# EAGLE design PentaFnord_LedBar_0_91r (EAGLE 6.2)

## Sheet 1 of 2
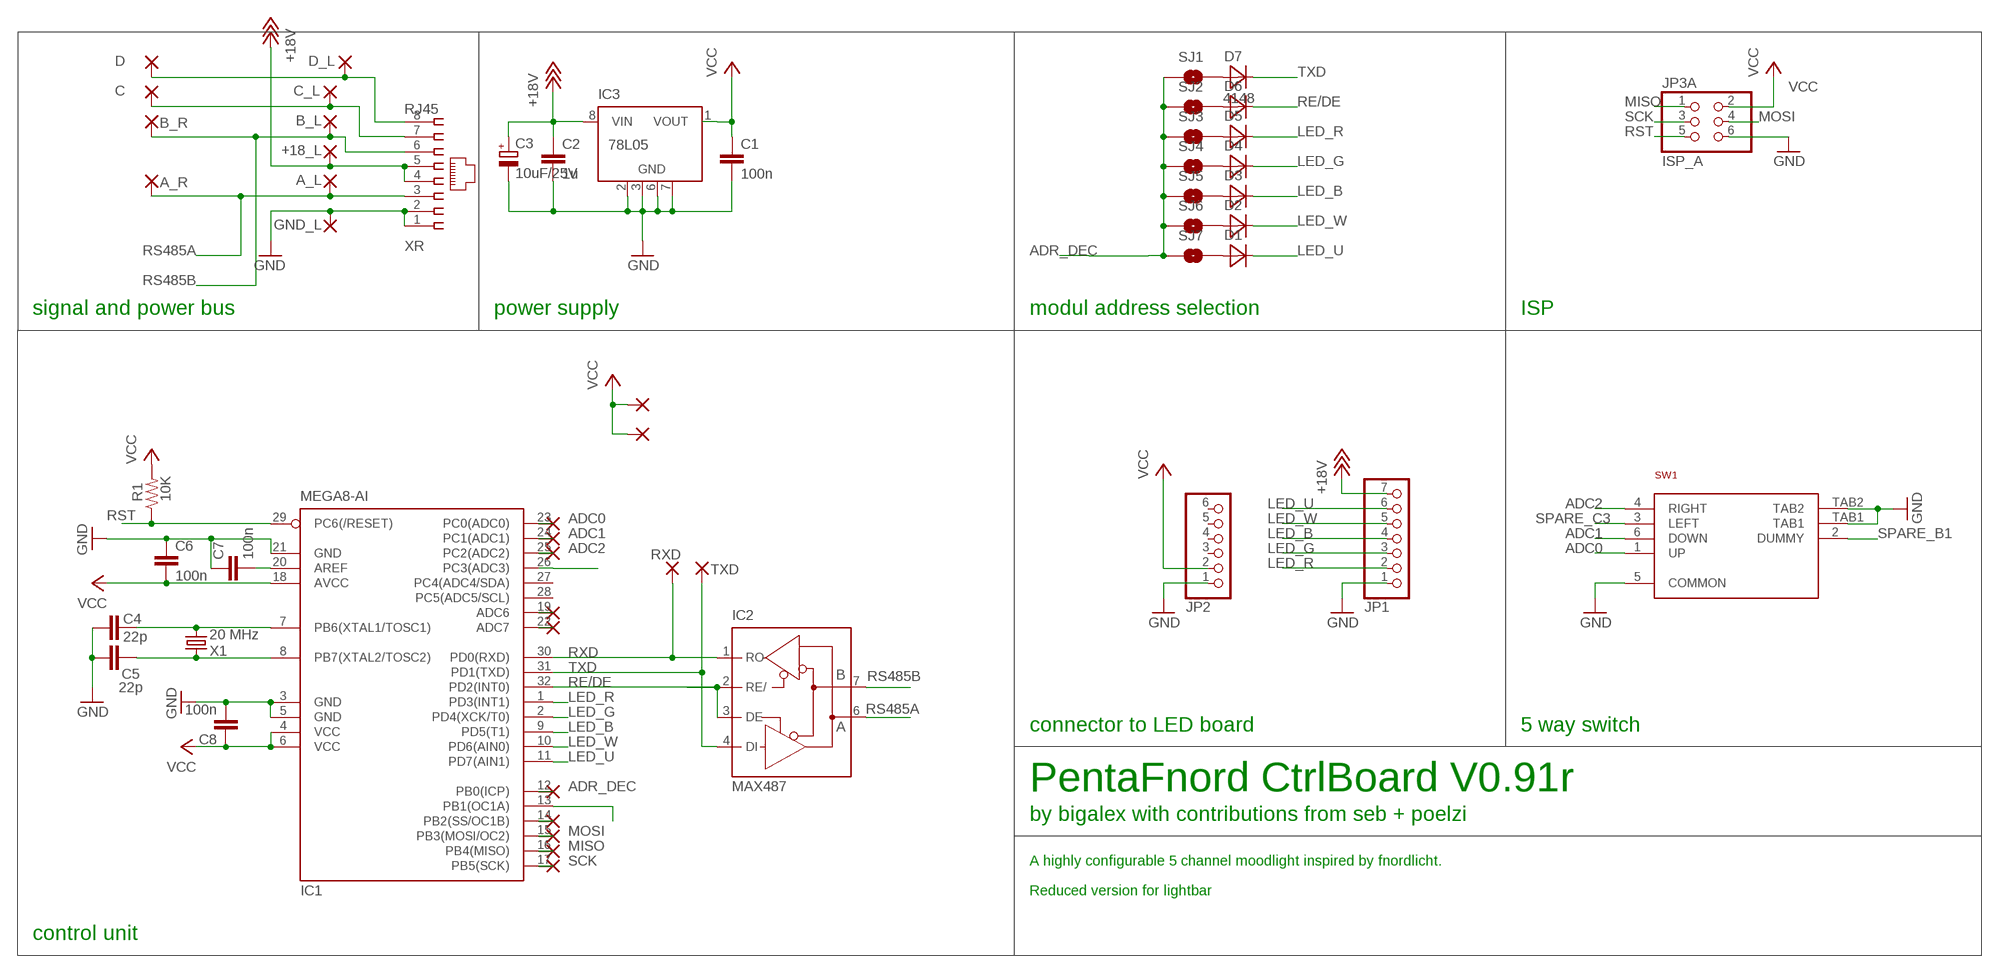
[diagram p0: schematic, sheet 1]

### Parts
+18_L  WIREPADSMD2,54-5,08  [SMD2,54-5,08]
A_L  WIREPADSMD2,54-5,08  [SMD2,54-5,08]
A_R  WIREPADSMD1,27-254  [SMD1,27-2,54]
ADC6  WIREPADSMD1,27-254  [SMD1,27-2,54]
ADC7  WIREPADSMD1,27-254  [SMD1,27-2,54]
B_L  WIREPADSMD2,54-5,08  [SMD2,54-5,08]
B_R  WIREPADSMD1,27-254  [SMD1,27-2,54]
C  WIREPADSMD1,27-254  [SMD1,27-2,54]
C1  100n  CAP0805  [0805]
C2  1u  CAP0805  [0805]
C3  10uF/25V  CPOL-EUSMCD  [SMC_D]
C4  22p  CAP0805  [0805]
C5  22p  CAP0805  [0805]
C6  100n  CAP0805  [0805]
C7  100n  CAP0805  [0805]
C8  100n  CAP0805  [0805]
C_L  WIREPADSMD2,54-5,08  [SMD2,54-5,08]
D  WIREPADSMD1,27-254  [SMD1,27-2,54]
D1  DIODE_0805  [DIODE_0805]
D2  DIODE_0805  [DIODE_0805]
D3  DIODE_0805  [DIODE_0805]
D4  DIODE_0805  [DIODE_0805]
D5  DIODE_0805  [DIODE_0805]
D6  DIODE_0805  [DIODE_0805]
D7  4148  DIODE_0805  [DIODE_0805]
D_L  WIREPADSMD2,54-5,08  [SMD2,54-5,08]
GND_L  WIREPADSMD2,54-5,08  [SMD2,54-5,08]
IC1  MEGA8-AI  [TQFP32-08]
IC2  MAX487  [SO08]
IC3  78L05  78L05SMD  [SO08]
JP1  PINHD-1X07_2.54-SMD-REVERSE  [1X07SMD-REVERSE]
JP2  PINHD-1X06_2.54-SMD  [1X06SMD]
JP3A  ISP_A  PINHD-2X03_2.54-SMD  [2X03SMD]
PAD3  WIREPADSMD1,27-254  [SMD1,27-2,54]
PAD4  WIREPADSMD1,27-254  [SMD1,27-2,54]
PB0  WIREPADSMD1,27-254  [SMD1,27-2,54]
PB2  WIREPADSMD1,27-254  [SMD1,27-2,54]
PB3  WIREPADSMD1,27-254  [SMD1,27-2,54]
PB4  WIREPADSMD1,27-254  [SMD1,27-2,54]
PB5  WIREPADSMD1,27-254  [SMD1,27-2,54]
PC0  WIREPADSMD1,27-254  [SMD1,27-2,54]
PC1  WIREPADSMD1,27-254  [SMD1,27-2,54]
PC2  WIREPADSMD1,27-254  [SMD1,27-2,54]
R1  10K  RESISTOR0805-RES  [0805]
RXD  WIREPADSMD2,54-5,08  [SMD2,54-5,08]
SJ1  SOLDERJUMPERNO  [SJ_2S-NO]
SJ2  SOLDERJUMPERNO  [SJ_2S-NO]
SJ3  SOLDERJUMPERNO  [SJ_2S-NO]
SJ4  SOLDERJUMPERNO  [SJ_2S-NO]
SJ5  SOLDERJUMPERNO  [SJ_2S-NO]
SJ6  SOLDERJUMPERNO  [SJ_2S-NO]
SJ7  SOLDERJUMPERNO  [SJ_2S-NO]
SW1  MCMT5-F-VADAPTED_FOOTPRINT  [MCMT5-F-V_ADAPTED]
TXD  WIREPADSMD2,54-5,08  [SMD2,54-5,08]
X1  20 MHz  CRYSTALSMD-SMALLER  [HC49UP-SMALL]
XR  RJ45  RJ45-SMDRJ45-SMALL  [85502-5008-SMALL]

### Nets
+18V: +18_L.1(P) C2.1 C3.+ IC3.8(VIN) JP1.7 XR.4 XR.5
ADC0: IC1.23(PC0(ADC0)) PC0.1(P) SW1.1(UP)
ADC1: IC1.24(PC1(ADC1)) PC1.1(P) SW1.6(DOWN)
ADC2: IC1.25(PC2(ADC2)) PC2.1(P) SW1.4(RIGHT)
ADR_DEC: IC1.12(PB0(ICP)) PB0.1(P) SJ1.1 SJ2.1 SJ3.1 SJ4.1 SJ5.1 SJ6.1 SJ7.1
GND: C1.2 C2.2 C3.- C4.1 C5.1 C6.1 C7.1 C8.2 GND_L.1(P) IC1.3(GND) IC1.5(GND) IC1.21(GND) IC3.2(GND) IC3.3(GND) IC3.6(GND) IC3.7(GND) JP1.1 JP2.1 JP3A.6 SW1.5(COMMON) SW1.TAB1 SW1.TAB2 XR.1 XR.2
LED_B: D3.1(C) IC1.9(PD5(T1)) JP1.4
LED_G: D4.1(C) IC1.2(PD4(XCK/T0)) JP1.3
LED_R: D5.1(C) IC1.1(PD3(INT1)) JP1.2
LED_U: D1.1(C) IC1.11(PD7(AIN1)) JP1.6
LED_W: D2.1(C) IC1.10(PD6(AIN0)) JP1.5
MISO: IC1.16(PB4(MISO)) JP3A.1 PB4.1(P)
MOSI: IC1.15(PB3(MOSI/OC2)) JP3A.4 PB3.1(P)
N$1: C.1(P) C_L.1(P) XR.7
N$2: D.1(P) D_L.1(P) XR.8
N$4: ADC6.1(P) IC1.19(ADC6)
N$9: ADC7.1(P) IC1.22(ADC7)
N$35: C5.2 IC1.8(PB7(XTAL2/TOSC2)) X1.2
N$36: C4.2 IC1.7(PB6(XTAL1/TOSC1)) X1.1
N$44: C7.2 IC1.20(AREF)
N$45: D7.2(A) SJ1.2
N$46: D6.2(A) SJ2.2
N$47: D5.2(A) SJ3.2
N$48: D4.2(A) SJ4.2
N$50: D3.2(A) SJ5.2
N$51: D2.2(A) SJ6.2
N$52: D1.2(A) SJ7.2
N$55: IC1.14(PB2(SS/OC1B)) PB2.1(P)
RE/DE: D6.1(C) IC1.32(PD2(INT0)) IC2.2(RE/) IC2.3(DE)
RS485A: A_L.1(P) A_R.1(P) IC2.6(A) XR.3
RS485B: B_L.1(P) B_R.1(P) IC2.7(B) XR.6
RST: IC1.29(PC6(/RESET)) JP3A.5 R1.1
RXD: IC1.30(PD0(RXD)) IC2.1(RO) RXD.1(P)
SCK: IC1.17(PB5(SCK)) JP3A.3 PB5.1(P)
SPARE_B1: IC1.13(PB1(OC1A)) SW1.2(DUMMY)
SPARE_C3: IC1.26(PC3(ADC3)) SW1.3(LEFT)
TXD: D7.1(C) IC1.31(PD1(TXD)) IC2.4(DI) TXD.1(P)
VCC: C1.1 C6.2 C8.1 IC1.4(VCC) IC1.6(VCC) IC1.18(AVCC) IC3.1(VOUT) JP2.2 JP3A.2 PAD3.1(P) PAD4.1(P) R1.2
Unconnected: IC1.27(PC4(ADC4/SDA)) IC1.28(PC5(ADC5/SCL)) IC3.4(NC) IC3.5(NC) JP2.3 JP2.4 JP2.5 JP2.6

### Notes on the sheet
- signal and power bus | power supply | modul address selection | ISP
- connector to LED board | 5 way switch
- PentaFnord CtrlBoard V0.91r
- by bigalex with contributions from seb + poelzi
- A highly configurable 5 channel moodlight inspired by fnordlicht.
- Reduced version for lightbar
- control unit

## Sheet 2 of 2
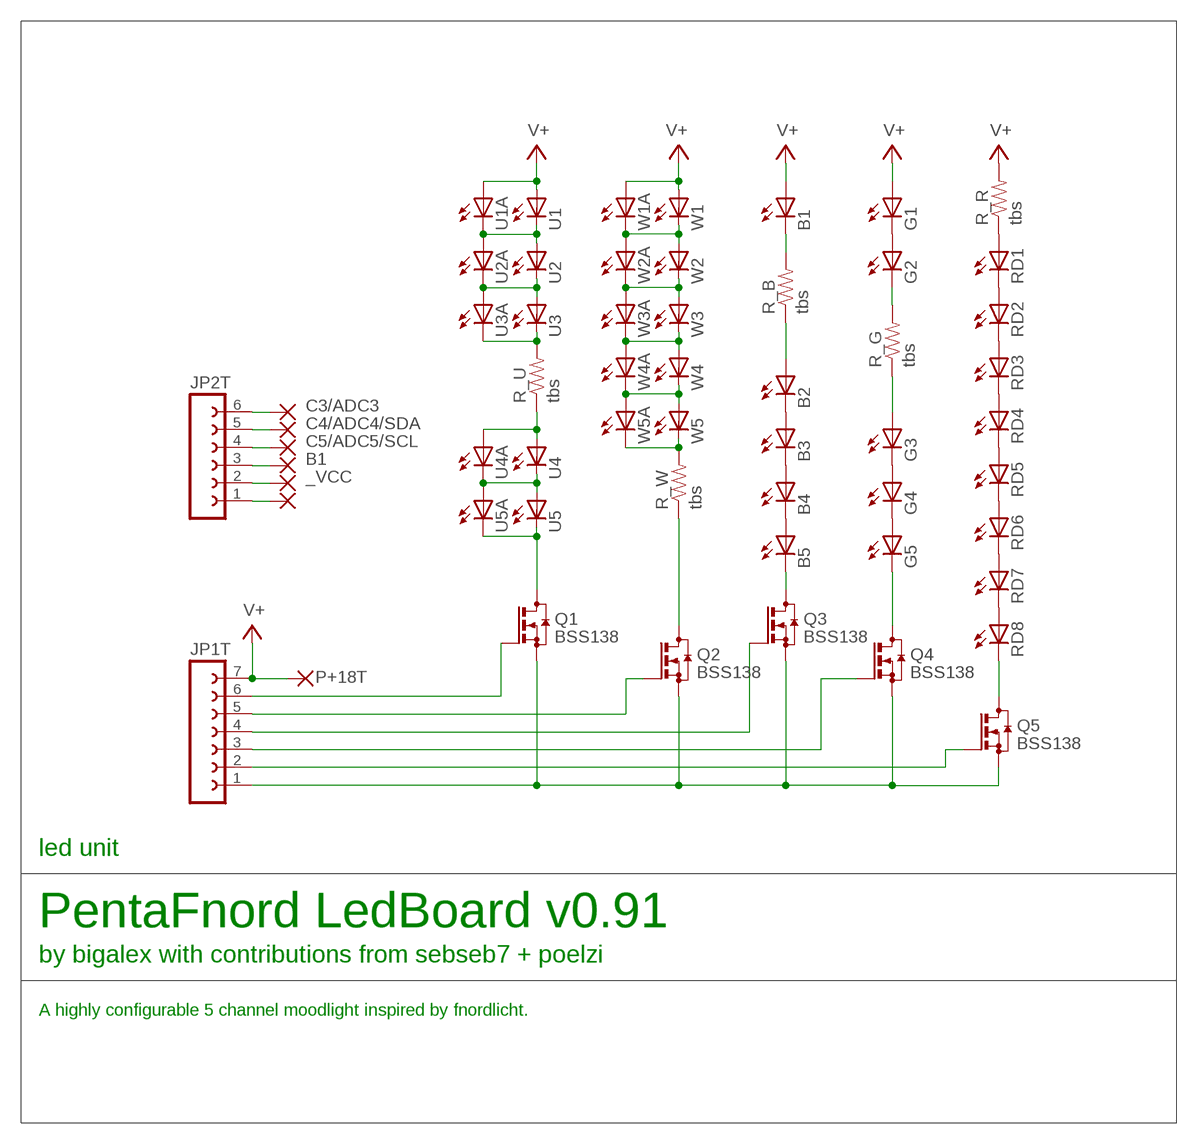
[diagram p1: schematic, sheet 2]

### Parts
B1  LED5MM  [LED5MM]
B2  LED5MM  [LED5MM]
B3  LED5MM  [LED5MM]
B4  LED5MM  [LED5MM]
B5  LED5MM  [LED5MM]
G1  LED5MM  [LED5MM]
G2  LED5MM  [LED5MM]
G3  LED5MM  [LED5MM]
G4  LED5MM  [LED5MM]
G5  LED5MM  [LED5MM]
JP1T  FE07-1  [FE07]
JP2T  FE06-1  [FE06]
P+5T  WIREPAD2,54/0,8  [2,54/0,8]
P+18T  WIREPAD2,54/0,8  [2,54/0,8]
PB1T  WIREPAD2,54/0,8  [2,54/0,8]
PC3T  WIREPAD2,54/0,8  [2,54/0,8]
PC4T  WIREPAD2,54/0,8  [2,54/0,8]
PC5T  WIREPAD2,54/0,8  [2,54/0,8]
PGNDT1  WIREPAD2,54/0,8  [2,54/0,8]
Q1  BSS138  BSS123  [SOT23]
Q2  BSS138  BSS123  [SOT23]
Q3  BSS138  BSS123  [SOT23]
Q4  BSS138  BSS123  [SOT23]
Q5  BSS138  BSS123  [SOT23]
R_B  tbs  RESISTOR1206  [1206]
R_G  tbs  RESISTOR1206  [1206]
R_R  tbs  RESISTOR1206  [1206]
R_U  tbs  RESISTOR1206  [1206]
R_W  tbs  RESISTOR1206  [1206]
RD1  LED5MM  [LED5MM]
RD2  LED5MM  [LED5MM]
RD3  LED5MM  [LED5MM]
RD4  LED5MM  [LED5MM]
RD5  LED5MM  [LED5MM]
RD6  LED5MM  [LED5MM]
RD7  LED5MM  [LED5MM]
RD8  LED5MM  [LED5MM]
U1  NICHIA_NSSL157T-H3  LED_PLCC2  [PLCC2]
U1A  LED5MM  [LED5MM]
U2  NICHIA_NSSL157T-H3  LED_PLCC2  [PLCC2]
U2A  LED5MM  [LED5MM]
U3  NICHIA_NSSL157T-H3  LED_PLCC2  [PLCC2]
U3A  LED5MM  [LED5MM]
U4  NICHIA_NSSL157T-H3  LED_PLCC2  [PLCC2]
U4A  LED5MM  [LED5MM]
U5  NICHIA_NSSL157T-H3  LED_PLCC2  [PLCC2]
U5A  LED5MM  [LED5MM]
W1  NICHIA_NSSL157T-H3  [NICHIA_NSSL157T-H3]
W1A  LED5MM  [LED5MM]
W2  NICHIA_NSSL157T-H3  [NICHIA_NSSL157T-H3]
W2A  LED5MM  [LED5MM]
W3  NICHIA_NSSL157T-H3  [NICHIA_NSSL157T-H3]
W3A  LED5MM  [LED5MM]
W4  NICHIA_NSSL157T-H3  [NICHIA_NSSL157T-H3]
W4A  LED5MM  [LED5MM]
W5  NICHIA_NSSL157T-H3  [NICHIA_NSSL157T-H3]
W5A  LED5MM  [LED5MM]

### Nets
_VCC: JP2T.2 P+5T.1(P)
B1: JP2T.3 PB1T.1(P)
C3/ADC3: JP2T.6 PC3T.1(P)
C4/ADC4/SDA: JP2T.5 PC4T.1(P)
C5/ADC5/SCL: JP2T.4 PC5T.1(P)
GND_T: JP1T.1 JP2T.1 PGNDT1.1(P) Q1.2(S) Q2.2(S) Q3.2(S) Q4.2(S) Q5.2(S)
N$3: U1.P$1(C) U1A.K(C) U2.P$2(A) U2A.A
N$5: W4.K@1(C) W4A.K(C) W5.A@2(A) W5A.A
N$6: Q1.3(D) U5.P$1(C) U5A.K(C)
N$7: Q2.3(D) R_W.1
N$8: W3.K@1(C) W3A.K(C) W4.A@2(A) W4A.A
N$10: R_U.2 U3.P$1(C) U3A.K(C)
N$11: U2.P$1(C) U2A.K(C) U3.P$2(A) U3A.A
N$12: U4.P$1(C) U4A.K(C) U5.P$2(A) U5A.A
N$13: G1.K(C) G2.A
N$14: B5.K(C) Q3.3(D)
N$15: G3.K(C) G4.A
N$16: G4.K(C) G5.A
N$17: B2.K(C) B3.A
N$18: B3.K(C) B4.A
N$19: B4.K(C) B5.A
N$20: G5.K(C) Q4.3(D)
N$21: RD1.K(C) RD2.A
N$22: RD2.K(C) RD3.A
N$23: RD3.K(C) RD4.A
N$24: RD4.K(C) RD5.A
N$25: RD5.K(C) RD6.A
N$26: RD6.K(C) RD7.A
N$27: R_R.1 RD1.A
N$28: RD7.K(C) RD8.A
N$29: B1.K(C) R_B.2
N$30: Q5.3(D) RD8.K(C)
N$31: B2.A R_B.1
N$32: G2.K(C) R_G.2
N$33: G3.A R_G.1
N$34: W2.K@1(C) W2A.K(C) W3.A@2(A) W3A.A
N$37: R_U.1 U4.P$2(A) U4A.A
N$38: R_W.2 W5.K@1(C) W5A.K(C)
N$39: JP1T.6 Q1.1(G)
N$40: JP1T.5 Q2.1(G)
N$41: JP1T.3 Q4.1(G)
N$42: JP1T.4 Q3.1(G)
N$43: JP1T.2 Q5.1(G)
N$54: W1.K@1(C) W1A.K(C) W2.A@2(A) W2A.A
V+: B1.A G1.A JP1T.7 P+18T.1(P) R_R.2 U1.P$2(A) U1A.A W1.A@2(A) W1A.A

### Notes on the sheet
- led unit
- PentaFnord LedBoard v0.91
- by bigalex with contributions from sebseb7 + poelzi
- A highly configurable 5 channel moodlight inspired by fnordlicht.

## Power pins joined to a net without a drawn wire
GND: IC2.5(GND)
VCC: IC2.8(VCC)

## Library data of the parts
+18_L A_L A_R ADC6 ADC7 B_L B_R C C_L D D_L GND_L P+5T P+18T PAD3 PAD4 PB0 PB1T PB2-PB5 PC0 PC1 PC2 PC3T PC4T PC5T PGNDT1 RXD TXD = wirepad:WIREPAD: Wire PAD connect wire on PCB
B1-B5 G1-G5 RD1-RD8 U1A U2A U3A U4A U5A W1A W2A W3A W4A W5A = Alex_personal:LED: LED OSRAM: - CHIPLED LG R971, LG N971, LY N971, LG Q971, LY Q971, LO R971, LY R971 LH N974, LH R974 LS Q976, LO Q976, LY Q976 LO Q996 - Hyper CHIPLED LW Q18S LB Q993, LB Q99A, LB R99A - SideLED LS A670, LO A670, LY A670, LG A670, LP A670 LB A673, LV A673, LT A673, LW A673 LH A674 LY A675 LS A676, LA A676, LO A676, LY A676, LW A676 LS A679, LY A679, LG A679 - Hyper Micro SIDELED® LS Y876, LA Y876, LO Y876, LY Y876 LT Y87S - SmartLED LW L88C, LW L88S LB L89C, LB L89S, LG L890 LS L89K, LO L89K, LY L89K LS L896, LA L896, LO L896, LY L896 - TOPLED LS T670, LO T670, LY T670, LG T670, LP T670 LSG T670, LSP T670, LSY T670, LOP T670, LYG T670 LG T671, LOG T671, LSG T671 LB T673, LV T673, LT T673, LW T673 LH T674 LS T676, LA T676, LO T676, LY T676, LB T676, LH T676, LSB T676, LW T676 LB T67C, LV T67C, LT T67C, LS T67K, LO T67K, LY T67K, LW E67C LS E67B, LA E67B, LO E67B, LY E67B, LB E67C, LV E67C, LT E67C LW T67C LS T679, LY T679, LG T679 LS T770, LO T770, LY T770, LG T770, LP T770 LB T773, LV T773, LT T773, LW T773 LH T774 LS E675, LA E675, LY E675, LS T675 LS T776, LA T776, LO T776, LY T776, LB T776 LHGB T686 LT T68C, LB T68C - Hyper Mini TOPLED® LB M676 - Mini TOPLED Santana® LG M470 LS M47K, LO M47K, LY M47K Source: http://www.osram.convergy.de LUXEON: - LUMILED® LXK2-PW12-R00, LXK2-PW12-S00, LXK2-PW14-U00, LXK2-PW14-V00 LXK2-PM12-R00, LXK2-PM12-S00, LXK2-PM14-U00 LXK2-PE12-Q00, LXK2-PE12-R00, LXK2-PE12-S00, LXK2-PE14-T00, LXK2-PE14-U00 LXK2-PB12-K00, LXK2-PB12-L00, LXK2-PB12-M00, LXK2-PB14-N00, LXK2-PB14-P00, LXK2-PB14-Q00 LXK2-PR12-L00, LXK2-PR12-M00, LXK2-PR14-Q00, LXK2-PR14-R00 LXK2-PD12-Q00, LXK2-PD12-R00, LXK2-PD12-S00 LXK2-PH12-R00, LXK2-PH12-S00 LXK2-PL12-P00, LXK2-PL12-Q00, LXK2-PL12-R00 Source: www.luxeon.com KINGBRIGHT: KA-3528ASYC Source: www.kingbright.com
C1 C2 C4-C8 = SparkFun:CAP: Capacitor Standard 0603 ceramic capacitor, and 0.1" leaded capacitor.
C3 = rcl:CPOL-EU: POLARIZED CAPACITOR, European symbol
D1-D7 = seb:DIODE_0805
IC1 = atmel:MEGA8: MICROCONTROLLER 8 Kbytes FLASH, 1 kbytes SRAM, 512 bytes EEPROM, USART, 6-channel 10 bit ADC, 2-channel 8 bit ADC Pin compatible with Atmega48, ATMega88, ATMega168 Source: avr.lbr; MPN: ATMEGA8-16AU; OC_FARNELL: 9171371; OC_NEWARK: 73M8863
IC2 = Alex_personal:MAX487: RS485 TRANSEIVER; MF: MAXIM; MPN: MAX487; OC_FARNELL: unknown; OC_NEWARK: unknown
IC3 = linear:78L*SMD: Positive VOLTAGE REGULATOR
JP1 = Alex_personal:PINHD-1X07: PIN HEADER
JP1T = con-lsta:FE07-1: FEMALE HEADER; OC_FARNELL: unknown; OC_NEWARK: unknown
JP2 = pinhead-2:PINHD-1X06: PIN HEADER
JP2T = con-lsta:FE06-1: FEMALE HEADER; OC_FARNELL: unknown; OC_NEWARK: unknown
JP3A = pinhead-2:PINHD-2X03: PIN HEADER
Q1-Q5 = transistor-small-signal:BSS123: N-CHANNEL MOS FET
R1 R_B R_G R_R R_U R_W = SparkFun:RESISTOR: Resistor Basic schematic elements and footprints for 0603, 1206, and PTH resistors.
SJ1-SJ7 = SparkFun:SOLDERJUMPER: Solder Jumper Standard SMD solder jumper. Used to automate production. Two varients : Normally Open and Normally Closed are the same, but have different paste layers. NC will have a large amount of paste and should jumper during reflow.
SW1 = alex3:MCMT5-F-V
U1-U5 = seb:LED_PLCC2
W1-W5 = seb:NICHIA_NSSL157T-H3
X1 = Alex_personal:CRYSTAL: Crystals Various standard crystals. Proven footprints. Spark Fun Electronics SKU : COM-00534
XR = Alex_personal:RJ45-SMD: AMP connector

## Board
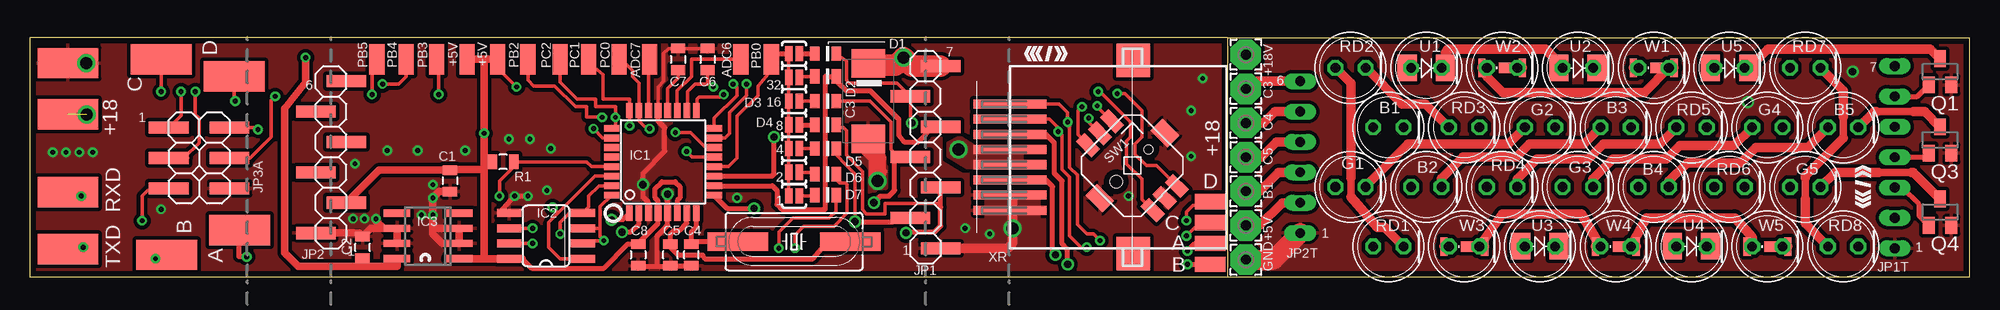
[diagram p2: board, top side]
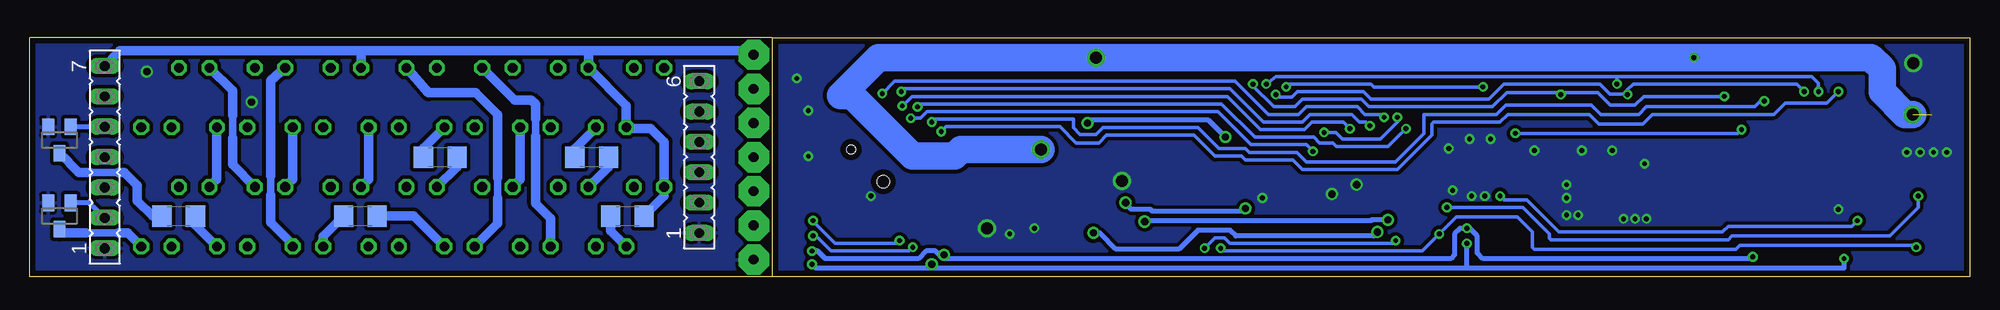
[diagram p3: board, bottom side, seen from below]

Size 162 x 20 mm. Coordinates in mm from the lower left corner, seen from the top.
Outline: 100,20 0,20 0,0 100,0
Outline: 100,0 162,0 162,20 100,20
Outline: 100,20 100,0
Copper layers (1*16): Top 0.035mm / dielectric 1.5mm / Bottom 0.035mm
Design rules: minimum track width 12mil, minimum drill 0.4mm, track to track 10mil, track to pad 10mil, pad to pad 8mil, via to via 10mil, smd to smd 8mil, copper to edge 20mil, drill to drill 8mil, minimum pad ring 10mil, minimum via ring 8mil, stop-mask expansion 4mil, vias tented up to drill 40mil, thermal gap 10mil

### Footprints (pad centres in the part's own frame; a part is rotated, then mirrored left to right if it is on the bottom)
SMD2,54-5,08 = smd 2.54 x 5.08: 1 0,0
SMD1,27-2,54 = smd 1.27 x 2.54: 1 0,0
LED5MM = drill 0.813 octagon: A -1.27,0; K 1.27,0
0805 = smd 0.8 x 1.2: 1 -0.9,0; 2 0.9,0
SMC_D = smd 2.4 x 2.8: + -3.15,0; - 3.15,0
DIODE_0805 = smd 0.8 x 1.2: 1 -0.9,0; 2 0.9,0
TQFP32-08 = smd 1.27 x 0.559: 1 -4.293,2.8; 2 -4.293,2; 3 -4.293,1.2; 4 -4.293,0.4; 5 -4.293,-0.4; 6 -4.293,-1.2; 7 -4.293,-2; 8 -4.293,-2.8; 17 4.293,-2.8; 18 4.293,-2; 19 4.293,-1.2; 20 4.293,-0.4; 21 4.293,0.4; 22 4.293,1.2; 23 4.293,2; 24 4.293,2.8 | smd 0.559 x 1.27: 9 -2.8,-4.293; 10 -2,-4.293; 11 -1.2,-4.293; 12 -0.4,-4.293; 13 0.4,-4.293; 14 1.2,-4.293; 15 2,-4.293; 16 2.8,-4.293; 25 2.8,4.293; 26 2,4.293; 27 1.2,4.293; 28 0.4,4.293; 29 -0.4,4.293; 30 -1.2,4.293; 31 -2,4.293; 32 -2.8,4.293
SO08 = smd 0.66 x 2.032: 1 -1.905,-3.073; 2 -0.635,-3.073; 3 0.635,-3.073; 4 1.905,-3.073; 5 1.905,3.073; 6 0.635,3.073; 7 -0.635,3.073; 8 -1.905,3.073
SO08' = smd 0.6 x 2.2: 1 -1.905,-2.6; 2 -0.635,-2.6; 3 0.635,-2.6; 4 1.905,-2.6; 5 1.905,2.6; 6 0.635,2.6; 7 -0.635,2.6; 8 -1.905,2.6
1X07SMD-REVERSE = smd 1.016 x 3.302: 1 -1.27,-1.27; 2 1.27,1.27; 3 3.81,-1.27; 4 6.35,1.27; 5 8.89,-1.27; 6 11.43,1.27; 7 13.97,-1.27
FE07 = drill 0.813 long: 1 -7.62,0; 2 -5.08,0; 3 -2.54,0; 4 0,0; 5 2.54,0; 6 5.08,0; 7 7.62,0
1X06SMD = smd 1.016 x 3.302: 1 -1.27,1.27; 2 1.27,-1.27; 3 3.81,1.27; 4 6.35,-1.27; 5 8.89,1.27; 6 11.43,-1.27
FE06 = drill 0.813 long: 1 -6.35,0; 2 -3.81,0; 3 -1.27,0; 4 1.27,0; 5 3.81,0; 6 6.35,0
2X03SMD = smd 1.016 x 3.302: 1 -1.27,-3.81; 2 -1.27,1.27; 3 1.27,-3.81; 4 1.27,1.27; 5 3.81,-3.81; 6 3.81,1.27
2,54/0,8 = drill 0.813 pad 2.54 octagon: 1 0,0
SOT23 = smd 1 x 1.4: 1 -0.95,-1.1; 2 0.95,-1.1; 3 0,1.1
1206 = smd 1.6 x 1.8: 1 -1.4,0; 2 1.4,0
SJ_2S-NO = smd 0.635 x 1.27: 1 -0.45,0; 2 0.45,0
MCMT5-F-V_ADAPTED = smd 1.858 x 1: 1 -3.829,1.425; 2 -3.829,0; 3 -3.829,-1.425; 4 3.829,1.425; 5 3.829,0; 6 3.829,-1.425 | smd 2 x 1.394: TAB1 0,3.847; TAB2 0,-3.847 | hole 1.05: 0,-1.9 | hole 0.75: 0,1.9
PLCC2 = smd 1.6 x 2.2: P$1 -1.6,0; P$2 1.6,0
NICHIA_NSSL157T-H3 = smd 0.64 x 0.86: A@1 1.08,0 | smd 0.6 x 1.55: A@2 1.7,0; K@1 -1.7,0 | smd 1.66 x 0.86: K@2 -0.57,0
HC49UP-SMALL = smd 5.08 x 1.524: 1 -4.699,0; 2 4.699,0
85502-5008-SMALL = smd 6.096 x 0.762: 1 10.211,4.445; 2 10.211,3.175; 3 10.211,1.905; 4 10.211,0.635; 5 10.211,-0.635; 6 10.211,-1.905; 7 10.211,-3.175; 8 10.211,-4.445 | smd 2.794 x 2.794: P$1 -0.076,-8.077; P$2 -0.076,8.077

### Placement (x,y rotation side)
+18_L  3.17,13.58 90 top
A_L  17.53,3.89 90 top
A_R  98.58,2.78 90 top
ADC6  59.37,18.18 0 top
ADC7  51.75,18.18 180 top
B1  113.46,12.49 0 top
B2  116.63,7.51 0 top
B3  132.45,12.49 0 top
B4  135.62,7.51 0 top
B5  151.44,12.49 0 top
B_L  11.43,1.83 90 top
B_R  98.58,1.04 90 top
C  98.58,4.53 90 top
C1  35.08,8.02 270 top
C2  27.78,2.46 90 top
C3  70.01,14.69 270 top
C4  53.5,1.83 90 top
C5  55.24,1.83 90 top
C6  56.59,18.18 270 top
C7  54.13,18.18 270 top
C8  50.8,1.83 270 top
C_L  10.95,18.18 90 top
D  98.58,6.27 90 top
D1  66.44,18.66 180 top
D2  66.44,16.75 180 top
D3  66.44,14.69 180 top
D4  66.44,12.7 180 top
D5  66.44,10.72 180 top
D6  66.44,8.58 180 top
D7  66.44,6.83 180 top
D_L  17.05,16.75 90 top
G1  110.3,7.51 0 top
G2  126.12,12.49 0 top
G3  129.29,7.51 0 top
G4  145.11,12.49 0 top
G5  148.28,7.51 0 top
GND_L  3.18,17.86 90 top
IC1  52.86,9.61 90 top
IC2  43.1,3.42 90 top
IC3  78L05  [SO08']  33.26,3.42 90 top
JP1  74.8,3.65 90 top
JP1T  155.75,10 90 bottom
JP2  25.15,4.92 90 top
JP2T  106.1,10 90 bottom
JP3A  15.4,11.19 270 top
P+5T  101.56,4.29 0 top
P+18T  101.56,18.57 0 top
PAD3  39.05,18.18 0 top
PAD4  36.51,18.18 0 top
PB0  61.91,18.18 180 top
PB1T  101.56,7.14 0 top
PB2  41.59,18.18 180 top
PB3  33.97,18.18 180 top
PB4  31.43,18.18 180 top
PB5  28.97,18.18 180 top
PC0  49.21,18.18 0 top
PC1  46.67,18.18 0 top
PC2  44.29,18.18 0 top
PC3T  101.56,15.72 0 top
PC4T  101.56,12.86 0 top
PC5T  101.56,10 0 top
PGNDT1  101.56,1.43 0 top
Q1  159.53,17.14 0 top
Q2  159.53,11.43 180 bottom
Q3  159.53,11.43 0 top
Q4  159.53,5.4 0 top
Q5  159.53,5.08 180 bottom
R1  39.53,9.61 180 top
R_B  115.08,9.98 180 bottom
R_G  127.73,9.98 180 bottom
R_R  112.1,5.08 0 bottom
R_U  134.4,5.08 0 bottom
R_W  149.58,5.08 0 bottom
RD1  113.46,2.53 0 top
RD2  110.3,17.47 0 top
RD3  119.79,12.49 0 top
RD4  122.96,7.51 0 top
RD5  138.78,12.49 0 top
RD6  141.95,7.51 0 top
RD7  148.28,17.47 0 top
RD8  151.44,2.53 0 top
RXD  3.17,7.07 90 top
SJ1  63.82,6.75 0 top
SJ2  63.82,8.73 0 top
SJ3  63.82,10.72 0 top
SJ4  63.82,12.7 0 top
SJ5  63.82,14.69 0 top
SJ6  63.82,16.67 0 top
SJ7  63.82,18.66 0 top
SW1  92.08,9.29 315 top
TXD  3.17,2.31 90 top
U1  116.63,17.45 180 top
U1A  116.63,17.47 0 top
U2  129.29,17.46 180 top
U2A  129.29,17.47 0 top
U3  126.11,2.55 180 top
U3A  126.12,2.53 0 top
U4  138.77,2.55 180 top
U4A  138.78,2.53 0 top
U5  141.95,17.46 180 top
U5A  141.95,17.47 0 top
W1  135.62,17.47 180 top
W1A  135.62,17.47 0 top
W2  122.96,17.47 180 top
W2A  122.96,17.47 0 top
W3  119.79,2.53 180 top
W3A  119.79,2.53 0 top
W4  132.45,2.53 180 top
W4A  132.45,2.53 0 top
W5  145.11,2.53 180 top
W5A  145.11,2.53 0 top
X1  63.82,2.94 180 top
XR  92.08,10 180 top

### Tracks (layer width: path | path; a pad name or v marks a point on that pad's centre or on a via)
+18V  (via drill 0.4, 1)  (1 unrouted)
  Top 0.406: XR.5 81.76,10.62
  Top 0.61: 27.62,0.88 22.38,0.88 21.27,1.99 21.27,14.05 23.02,16.27 v23.02,18.33 | 27.62,0.88 30.66,0.88 IC3.8 | JP1.7 75.64,17.62 75.56,17.7 | 70.14,17.7 arc-90 C3.+ | C2.1 27.62,1.41 27.62,0.88
  Top 1.778: 70.14,17.7 72.31,17.7 v72.95,18.34 73.66,17.62 JP1.7
  Bottom 0.406: 42.55,18.82 43.34,18.82 43.34,18.33 | 73.74,17.7 74.14,18.34 77.95,18.33
  Bottom 0.61: 73.74,17.7 73.1,18.34 v72.95,18.34
  Bottom 2.311: v77.55,10.64 84.22,10.64 84.77,10.08 88.27,10.08 93.34,15.16 94.3,15.16 91.13,18.33 77.95,18.33 43.34,18.33 v23.02,18.33 8.25,18.33 7.3,17.39 7.3,15.48 5.4,13.58 v4.76,13.58
  pour Top (no thermals): 82.87,10.88 82.87,9.13 78.26,9.13 76.68,10.08 76.68,11.19 77.63,11.67 78.9,10.88
_VCC
  Top 0.813: JP2T.2 104.6,6.19 102.7,4.29 P+5T.1
ADC0  (via drill 0.4)
  Top 0.305: PC0.1 49.37,17.23 | 49.37,17.23 | PC0.1 49.21,17.39 | PC0.1 49.37,18.18 50.32,17.23 50.32,16.75 50.86,16.21 IC1.23 50.86,13.04 51.51,12.39 v51.75,12.39 | v89.14,14.29 89.14,14.24 SW1.1
  Bottom 0.305: v51.75,12.39 52.31,12.94 54.93,12.94 55.56,12.31 59.21,12.31 61.99,15.08 88.34,15.08 v89.14,14.29
ADC1  (via drill 0.4, 0.4 pad 0.01)
  Top 0.305: PC1.1 46.83,18.02 46.83,17.7 46.91,17.7 47.86,16.91 47.86,14.85 50.07,14.85 IC1.24 50.06,12.65 v50.09,12.62 | SW1.6 92.87,6.48 92.87,8.18 91.6,9.45 91.6,11.35 91.92,11.67 91.92,12.94 89.38,15.48 v89.22,15.48
  Bottom 0.305: v50.09,12.62 50.4,12.94 50.96,12.94 51.59,13.58 55.09,13.58 55.72,12.94 58.98,12.94 61.75,15.72 88.98,15.72 v89.22,15.48
ADC2  (via drill 0.4)
  Top 0.305: IC1.25 48.9,12.41 v48.9,13.34 48.9,14.21 47.23,14.21 47.23,14.85 45.72,14.85 44.29,16.28 PC2.1 | SW1.4 94.09,9.29 93.27,9.29 92.31,10.24 92.31,11.12 92.87,11.67 92.87,13.89 91.44,15.32 v90.81,15.32
  Bottom 0.305: v48.9,13.34 49.13,13.58 50.48,13.58 51.12,14.21 55.4,14.21 56.04,13.58 58.58,13.58 61.36,16.35 89.77,16.35 v90.81,15.32
ADR_DEC
  Top 0.305: SJ7.1 SJ6.1 | 62.05,18.61 61.91,18.47 61.91,17.23 60.8,15.96 60.8,15.16 59.05,13.42 59.05,9.93 58.34,9.21 IC1.12 57.08,9.13 | SJ1.1 63.37,6.35 SJ2.1 SJ3.1 SJ4.1 | SJ6.1 | SJ6.1 | SJ6.1 SJ5.1 SJ4.1 | SJ4.1
  Top 0.406: PB0.1 62.05,18.61 62.07,18.66 SJ7.1
B1
  Top 0.813: JP2T.3 104.28,8.73 102.7,7.14 PB1T.1
C3/ADC3
  Top 0.813: JP2T.6 102.19,16.35 PC3T.1
C4/ADC4/SDA
  Top 0.813: JP2T.5 103.97,13.81 103.02,12.86 PC4T.1
C5/ADC5/SCL
  Top 0.813: JP2T.4 104.13,11.27 102.86,10 PC5T.1
GND  (via drill 0.4, 0.6, 1)
  Top 0.305: C7.1 53.34,19.08 52.94,18.68 52.94,16.36 52.46,15.88 52.46,15.25 IC1.21 | C7.1 | C7.1 C6.1 | 88.58,6.59 SW1.TAB2
  Top 0.406: IC2.5 39.21,5.32 v40.48,6.75 v41.59,6.75 | IC1.21 52.46,13.02 53.02,12.46 53.02,10.48 51.2,8.65 v51.2,7.7 51.2,6.67 51.66,6.2 IC1.3 | 53.26,4.29 IC1.5 v53.26,6.91 | 52.39,0.88 53.45,0.88 C4.1 C5.1 | 53.26,4.29 | 53.26,4.29 52.39,3.42 52.39,0.88 | 52.39,0.88 50.85,0.88 C8.2
  Top 0.61: 22.54,3.73 23.79,3.73 JP2.1 27.5,3.65 C2.2 28.47,4.05 IC3.6 | IC3.7 IC3.6 | IC3.3 IC3.2 34.45,2.78 33.66,3.58 v33.66,5.16 v33.66,6.59 34.18,7.12 C1.2 | v28.89,4.84 28.89,4.69 29.53,4.05 IC3.6 | IC3.3 | IC3.3 33.81,4.05 | 71.28,8.81
  Top 0.813: 82.07,5.89 82.07,6.49 XR.2 | 82.07,5.89 v82.07,4.05 82.07,2.78 81.67,2.38 JP1.1 | 82.07,5.89 XR.1
  Top 1.422: v70.8,8.02 70.8,8.65 70.8,9.93 70.01,10.72 C3.-
  other vias: 10.95,5.64 4.68,17.86 97,10.08 91.76,6.75 43.18,7.23 59.05,6.59 1.91,10.4 3.02,10.4 4.13,10.4 5.24,10.4 27.94,4.85 26.99,4.85 32.7,5.16 33.66,7.7 36.35,10.56 32.39,10.56 27.15,9.45 29.85,10.56 40.01,11.51 41.75,11.51 43.5,10.72 80.17,3.58 78.11,4.05 97.95,16.59 97,13.89
  pour Bottom (isolate 0.305): -0.16,-0.08 100.17,-0.08 100.17,20.09 -0.16,20.09
  pour Top (isolate 0.305, rank 2): 100.17,20.09 100.17,-0.08 -0.16,-0.08 -0.16,20.09
  pour Top (no thermals): 79.85,3.42 79.85,6.59 84.3,6.59 84.3,3.42
GND_T  (via drill 0.6)
  Top 1.676: JP2T.1 103.88,1.43 PGNDT1.1
  other vias: 143.5,14.61 152.23,17.14
  pour Bottom (isolate 0.305): 100,20 162,20 162,0 100,0
  pour Top (isolate 0.305): 100,20 162,20 162,0 100,0
LED_B  (via drill 0.6)
  Top 0.305: 73.18,9.77 73.3,9.77 JP1.4 | D3.1 70.17,14.69 71.91,12.94 71.91,10.63 72.55,10
  Top 0.406: IC1.9 58.24,5.72 v60.48,5.72 | 72.31,10 72.23,10.08 | 72.31,10 72.55,10 JP1.4 | v70.48,6.19 71.04,6.75 71.75,6.75 72.23,7.23 72.23,9.92 72.31,10
  Bottom 0.406: v70.48,6.19 70.01,5.64 68.42,5.64 68.26,5.48 60.72,5.48 v60.48,5.72
LED_G  (via drill 0.6)
  Top 0.305: D4.1 67.5,12.46 67.94,12.46 68.18,12.23 68.18,10.16 69.53,8.81 69.53,5.64 69.85,5.24 71.44,5.24 71.44,6.12 75.76,6.12 arc-90 76.07,5.8
  Top 0.406: IC1.2 50.86,4.43 50.16,3.73 v49.45,3.73 | JP1.3 76.07,5.8 76.07,4.24 75.56,3.73 73.26,3.73 v73.18,3.65
  Bottom 0.406: v73.18,3.65 72.63,3.65 71.28,2.31 66.04,2.31 64.45,3.89 61.75,3.89 61.28,3.42 49.77,3.42 v49.45,3.73
LED_R  (via drill 0.6)
  Top 0.305: D5.1 67.34,10.22 68.18,9.29 68.9,8.57 v68.9,4.61
  Top 0.406: JP1.2 72.16,4.92 72.07,5 72.07,4.61 v68.9,4.61 | IC1.1 49.51,4.77 v48.58,4.77
  Bottom 0.406: v68.9,4.61 arc90 68.82,4.69 50,4.69 49.92,4.77 v48.58,4.77
LED_U  (via drill 0.6)
  Top 0.305: D1.1 68.18,18.05 68.18,16.43 68.42,16.2 72.42,16.2 JP1.6 73.53,12.99 v73.66,12.86
  Top 0.406: IC1.11 61.98,8.41 62.15,8.58 v62.15,11.67
  Bottom 0.406: v73.66,12.86 73.42,13.1 63.58,13.1 v62.15,11.67
LED_W
  Top 0.406: JP1.5 76.12,12.54 | D2.1 66.44,16.75 66.44,5.64 62.79,5.64 62.39,6.04 62.39,7.23 62.01,7.61 IC1.10 | D2.1 | 70.96,14.77 | D2.1 67.47,16.62 67.47,16.27 68.18,15.56 70.17,15.56 70.96,14.77 | JP1.5 75.99,12.46 | 70.96,14.77 72.55,13.18 72.55,11.83 73.03,11.27 74.22,11.27 75.48,12.54 JP1.5
MISO  (via drill 0.4)
  Top 0.305: 31.59,18.02 PB4.1 31.43,16.75 30.8,16.12 v29.45,16.12 | IC1.16 57.16,13.27 59.05,15.16 59.05,15.8 v58.74,16.12 | v12.62,15.48 12.62,13.5 JP3A.1
  Bottom 0.305: v58.74,16.12 57.94,16.75 29.37,16.75 | 29.37,16.75 13.18,16.75 12.62,16.2 v12.62,15.48 | v29.45,16.12 29.45,16.67 arc90 29.37,16.75
MOSI  (via drill 0.4)
  Top 0.305: v34.13,15.24 34.13,15.09 34.13,18.02 PB3.1 | IC1.15 58.04,11.61 58.42,11.99 58.42,13.73 59.85,15.16 v59.85,16.12 | JP3A.4 | 18.26,9.93 JP3A.4 | v20.48,15.09 20.16,14.77 20.16,11.67 18.42,9.93 JP3A.4
  Bottom 0.305: v59.85,16.12 59.85,15.96 58.1,14.21 56.36,14.21 55.72,14.85 50.8,14.85 50.16,14.21 39.85,14.21 38.66,15.4 34.13,15.4 | 34.13,15.4 v34.13,15.24 | 34.13,15.4 | 34.13,15.4 31.04,15.4 30,14.37 27.94,14.37 27.22,15.09 v20.48,15.09
N$1  (via drill 0.4)
  Top 0.305: XR.7 85.17,13.18 85.88,12.46 v85.88,12.15 86.2,11.83 86.2,8.97 86.84,8.34 86.84,3.42 87.79,2.46 v88.27,2.46 | 97.79,4.53 C.1 97.71,4.53 v96.6,3.42 | C_L.1 v10.95,15.48
  Bottom 0.305: v85.88,12.15 85.49,12.54 75.96,12.54 74.61,11.2 72.71,11.2 72.07,11.83 64.77,11.83 63.02,10.08 60.8,10.08 60.48,9.77 56.52,9.77 55.72,8.97 47.78,8.97 44.93,11.83 44.93,12.78 44.77,12.94 39.21,12.94 38.58,13.58 31.75,13.58 30.96,12.78 27.31,12.78 26.51,13.58 16.35,13.58 15.4,14.53 11.91,14.53 v10.95,15.48 | v88.27,2.46 88.58,2.15 95.09,2.15 96.36,3.42 v96.6,3.42
N$2  (via drill 0.4)
  Top 0.305: XR.8 85.97,14.45 86.68,13.73 v86.68,12.94 86.84,12.78 86.84,9.13 87.47,8.5 87.47,4.37 88.27,3.58 88.82,3.58 v89.38,3.02 | D.1 98.27,5.96 97.16,5.96 96.6,5.4 v96.6,4.69 | v17.14,14.69 17.05,14.78 D_L.1
  Bottom 0.305: v86.68,12.94 86.52,13.18 74.85,13.18 74.85,12.46 74.3,11.91 72.94,11.91 72.39,12.46 64.45,12.46 62.71,10.72 60.48,10.72 60.17,10.4 56.2,10.4 55.4,9.61 47.94,9.61 45.56,11.99 45.56,13.58 39.53,13.58 38.73,14.37 31.59,14.37 30.8,13.58 27.62,13.58 26.99,14.21 17.94,14.21 17.46,14.69 v17.14,14.69 | v89.38,3.02 89.61,2.78 94.77,2.78 96.6,4.61 v96.6,4.69
N$3
  Top 0.813: U1A.K U1.P$1 118.23,18.7 118.41,19.05 126.6,19.05 U2A.A U2.P$2
N$4
  Top 0.305: ADC6.1 56.04,18.18 55.24,18.18 55.24,16.75 54.06,15.57 IC1.19
N$5
  Top 0.305: W5A.A W5.A@2
  Top 0.813: W5A.A 143.84,3.31 143.3,3.91 142.39,4.92 135,4.92 W4A.K W4.K@1
N$6
  Top 0.813: U5A.K U5.P$1 145.15,19.05 158.73,19.05 Q1.3
N$7
  Bottom 0.61: 154.61,8.73 156.98,8.73
  Bottom 0.813: 156.98,8.73 157.93,8.73 Q2.3 | 154.61,8.73 154.13,8.73 153.02,7.62 153.02,6.35 151.75,5.08 R_W.1
N$8
  Top 0.813: W3.K@1 W3A.K 122.98,5.24 129.58,5.24 W4A.A W4.A@2
N$9
  Top 0.305: 51.59,18.02 ADC7.1 51.66,18.18 51.66,15.09 IC1.22
N$10
  Top 0.813: U3A.K U3.P$1
  Bottom 0.813: U3A.K 129.94,5.08 R_U.2
N$11
  Top 0.813: U3A.A U3.P$2 | U2A.K U2.P$1
  Bottom 0.61: 122.94,6.59 122.94,8.26
  Bottom 0.813: U2A.K 128.73,15.4 124.77,15.4 122.94,13.57 122.94,8.26 | 122.94,6.59 122.94,4.44 U3A.A
N$12
  Top 0.406: U5A.A U5.P$2
  Top 0.813: U4A.K U4.P$1
  Bottom 0.61: 141.91,6.83 141.91,8.41
  Bottom 0.813: U5A.A 141.91,16.4 141.91,8.41 | 141.91,6.83 141.91,4.55 140.05,2.69 U4A.K
N$13
  Top 0.813: G2.A 123.47,11.11 115.08,11.11 111.57,7.6 G1.K
N$14
  Top 0.61: 154.19,13.81 157.3,13.81
  Top 0.813: 154.19,13.81 154.03,13.81 B5.K | 157.3,13.81 158.25,13.81 Q3.3
N$15
  Top 0.813: G4.A 142.31,10.95 137.78,10.95 136.67,9.84 132.23,9.84 130.56,8.17 G3.K
N$16
  Bottom 0.813: G4.K 146.38,8.13 G5.A
N$17
  Top 0.813: B3.A 129.81,11.11 125.24,11.11 124.13,10 119.69,10 117.9,8.21 B2.K
N$18
  Bottom 0.813: B3.K 133.72,8.13 B4.A
N$19
  Top 0.813: B5.A 148.48,10.79 144.13,10.79 142.86,9.53 138.42,9.53 136.89,8 B4.K
N$20
  Top 0.61: 154.42,8.73 157.14,8.73
  Top 0.813: 154.42,8.73 150.77,8.73 G5.K | 157.14,8.73 157.3,8.73 Q4.3
N$21
  Top 0.61: 110.32,6.67 110.32,8.26
  Top 0.813: RD2.A 110.32,16.18 110.32,8.26 | 110.32,6.67 112.54,4.13 113.18,4.13 113.18,4.09 RD1.K
N$22
  Top 0.813: RD2.K 114.59,14.45 116.57,14.45 RD3.A
N$23
  Bottom 0.813: RD3.K 121.06,8.13 RD4.A
N$24
  Top 0.813: RD5.A 136.13,11.11 131.43,11.11 130.16,9.84 125.88,9.84 124.23,8.19 RD4.K
N$25
  Bottom 0.813: RD5.K 140.05,8.13 RD6.A
N$26
  Bottom 0.61: 145.09,11.59 145.09,13.49
  Bottom 0.813: RD6.K 145.09,9.38 145.09,11.59 | 145.09,13.49 145.09,15.55 RD7.A
N$27
  Bottom 0.813: R_R.1 113.5,3.83 RD1.A
N$28
  Top 0.61: 148.26,6.51 148.26,8.26 | 151.44,11.59 151.44,13.36
  Top 0.813: 148.26,6.51 148.26,4.44 RD8.A | 148.26,8.26 148.26,8.41 151.44,11.59 | 151.44,13.36 151.44,15.58 RD7.K
N$29
  Bottom 0.813: B1.K 116.48,10.74 R_B.2
N$30
  Bottom 0.61: 154.61,3.65 157.3,3.65
  Bottom 0.813: 154.61,3.65 153.83,3.65 RD8.K | 157.3,3.65 159.53,3.65 Q5.3
N$31
  Bottom 0.813: R_B.1 113.68,9.19 B2.A
N$32
  Bottom 0.813: G2.K 129.13,10.75 R_G.2
N$33
  Bottom 0.813: R_G.1 126.33,9.19 G3.A
N$34
  Top 0.813: W3A.A W3.A@2 | W2A.K W2.K@1
  Bottom 0.61: 119.77,11.75 119.77,13.18
  Bottom 0.813: W3A.A 118.52,4.87 119.77,6.11 119.77,11.75 | 119.77,13.18 119.77,14.45 120.16,14.76 121.52,14.76 W2A.K
N$35
  Top 0.406: IC1.8 55.66,4.15 55.24,3.73 C5.2 55.46,2.94 X1.2
N$36
  Top 0.406: IC1.7 54.86,4.46 54.29,3.89 53.82,3.89 53.5,3.58 C4.2 | C4.2 | X1.1 66.67,2.94 65.41,1.51 56.36,1.51 56.2,1.83 54.13,1.83 53.5,2.46 C4.2 | C4.2
N$37
  Top 0.813: U4A.A U4.P$2
  Bottom 0.813: R_U.1 137.51,3.37 U4A.A
N$38
  Top 0.813: W5.K@1 W5A.K
  Bottom 0.813: W5A.K 148.18,4.33 R_W.2
N$39
  Top 0.406: JP1T.6 157.62,15.08 Q1.1
N$40
  Bottom 0.406: JP1T.5 155.76,12.53 Q2.1
N$41
  Top 0.406: JP1T.3 156.36,7.46 157.78,6.03 157.78,5.09 Q4.1
N$42
  Top 0.406: JP1T.4 158.25,10 Q3.1
N$43
  Bottom 0.406: JP1T.2 157.09,6.18 Q5.1
N$44
  Top 0.305: IC1.20 53.26,15.72 54.13,16.59 C7.2
N$45
  Top 0.305: SJ1.2 65.54,6.75 D7.2
N$46
  Top 0.305: SJ2.2 65.54,8.73 D6.2
N$47
  Top 0.305: SJ3.2 D5.2
N$48
  Top 0.406: SJ4.2 | SJ4.2 D4.2
N$50
  Top 0.305: SJ5.2 D3.2
N$51
  Top 0.305: SJ6.2 64.35,16.75 D2.2
N$52
  Top 0.406: D1.2 64.43,18.66 SJ7.2
N$54
  Top 0.813: W1.K@1 W1A.K 134.82,15.4 123.02,15.4 121.69,16.73 W2A.A W2.A@2
N$55  (via drill 0.4)
  Top 0.305: 41.91,17.86 PB2.1 41.59,16.43 42.07,15.96 43.81,15.96 45.56,14.21 46.51,14.21 46.51,13.34 v47.78,13.34 | IC1.14 56.43,10.81 55.17,12.07 v53.9,12.07
  Bottom 0.305: v47.78,13.34 47.78,12.94 49.21,11.51 52.39,11.51 52.94,12.07 v53.9,12.07
RE/DE  (via drill 0.4)
  Top 0.305: D6.1 67.34,8.15 67.63,7.86 68.1,7.86 68.26,7.7 68.26,5.32 67.15,4.21 64.61,4.21 63.9,3.5 v63.9,2.38 | IC1.32 47.62,5.86 47.62,4.05 | 47.62,4.05 IC2.3 | 47.62,4.05 47.62,3.34 v47.94,3.02 46.41,3.02 IC2.2
  Bottom 0.305: v63.9,2.38 63.02,3.26 62.23,3.26 61.75,2.78 48.18,2.78 v47.94,3.02
RS485A  (via drill 0.4, 0.6)
  Top 0.305: v41.99,4.05 IC2.6
  Top 0.406: 81.81,8.02 XR.3 84.86,8.1 85.41,7.54 85.41,2.07 v85.65,1.83 | v96.68,2.15 97.31,2.78 A_R.1 | v18.1,1.67 17.46,1.67 A_L.1
  Bottom 0.406: 85.72,1.51 43.34,1.51 43.02,1.83 43.02,3.58 42.55,4.05 v41.99,4.05 41.75,4.05 41.12,3.42 41.12,1.99 40.64,1.51 18.26,1.51 v18.1,1.67 | v85.65,1.83 85.65,1.59 85.72,1.51 | 85.72,1.51 86.36,2.15 87.15,2.15 87.79,1.51 95.57,1.51 96.2,2.15 v96.68,2.15
RS485B  (via drill 0.4, 0.6)
  Top 0.305: v41.99,2.78 IC2.7
  Top 0.406: IC2.7 40.34,2.92 | XR.6 84.86,11.9 85.57,11.2 85.57,8.65 86.2,8.02 86.2,2.78 86.68,2.31 v86.68,1.03 | v96.68,1.03 B_R.1 | v96.68,1.03 | v10.48,1.51 | v10.48,1.51 B_L.1
  Bottom 0.406: 41.99,0.72 86.68,0.72 | 89.69,0.72 | 41.99,0.72 v41.99,2.78 | 86.68,0.72 v86.68,1.03 | 86.68,0.72 89.69,0.72 | 89.69,0.72 96.36,0.72 v96.68,1.03 | 41.99,0.72 10.48,0.72 v10.48,1.51
RST  (via drill 0.4)
  Top 0.305: IC1.29 46.91,9.21 46.51,9.61 R1.1 40.43,9.24 39.21,8.02 v39.21,6.75 | v9.37,4.69 9.37,6.75 9.84,7.23 11.43,7.23 JP3A.5
  Bottom 0.305: v9.37,4.69 9.84,4.21 20.16,4.21 20.64,3.73 34.29,3.73 36.99,6.43 38.89,6.43 v39.21,6.75
RXD  (via drill 0.4)
  Top 0.305: 45.32,1.67 46.02,1.67 IC2.1 44.29,1.51 43.34,2.46 43.34,4.53 44.13,5.32 | IC1.30 47.22,8.41 44.13,5.32 | RXD.1 v4.29,6.75 | v43.66,5.8 44.13,5.32
  Bottom 0.305: v43.66,5.8 37.31,5.8 35.08,3.58 35.08,3.26 arc-90 34.92,3.1 20.16,3.1 19.84,3.42 6.67,3.42 4.29,5.8 v4.29,6.75
SCK  (via drill 0.4)
  Top 0.305: 29.05,18.02 PB5.1 28.89,17.23 28.58,16.91 v28.58,15.24 | v57.94,15.24 57.71,15.01 55.88,15.01 55.72,14.85 55.72,13.96 IC1.17 | 13.18,9.93 JP3A.3 12.86,9.93 14.13,11.2 14.13,13.26 13.81,13.58 v13.81,15.48
  Bottom 0.305: v57.94,15.24 57.71,15.01 56.59,15.01 56.12,15.48 50.64,15.48 50.01,14.85 40.16,14.85 38.89,16.12 30.88,16.12 30.04,15.28 29.02,15.28 v28.58,15.24 28.58,15.64 28.1,16.12 14.45,16.12 v13.81,15.48
SPARE_B1  (via drill 0.4)
  Top 0.305: v88.42,13.26 88.42,12.94 SW1.2 | IC1.13 55.32,10.01 v54.85,10.48
  Bottom 0.305: 54.77,10.4 v54.85,10.48 55.4,11.04 60.01,11.04 62.79,13.81 87.07,13.81 87.63,13.26 v88.42,13.26
SPARE_C3  (via drill 0.4)
  Top 0.305: IC1.26 47.85,11.61 v47.07,12.39 | SW1.3 87.55,11.88 87.55,13.89 v87.87,14.21
  Bottom 0.305: v47.07,12.39 48.58,10.88 52.86,10.88 53.18,11.2 54.29,11.2 54.77,11.67 59.69,11.67 62.47,14.45 87.63,14.45 v87.87,14.21
TXD  (via drill 0.4)
  Top 0.305: IC1.31 47.53,7.61 46.67,6.75 46.67,5.82 IC2.4 45.09,5.32 44.29,4.53 v44.29,3.58 | D7.1 67.31,6.49 67.31,5.48 66.75,4.92 63.74,4.92 62.55,3.73 v62.55,2.38 | v4.44,2.46 TXD.1
  Bottom 0.305: 62.39,2.23 v62.55,2.38 62.31,2.15 45.72,2.15 v44.29,3.58 42.86,5 37.78,5 36.51,3.73 36.51,2.46 36.35,2.31 19.53,2.31 19.21,2.62 4.6,2.62 arc90 v4.44,2.46
V+
  Top 0.406: U1A.A U1.P$2
  Top 0.813: W1A.A W1.A@2
  Bottom 0.813: JP1T.7 154.48,18.89 134.29,18.89 | 115.24,18.89 101.71,18.89 arc90 P+18T.1 | 115.24,18.89 arc-90 115.36,18.77 U1A.A 112.19,14.3 B1.A 112.09,12.38 110.16,12.38 109.03,11.25 G1.A 109.03,6.75 R_R.2 | 115.24,18.89 134.29,18.89 | W1A.A 134.35,18.83 134.29,18.89
VCC  (via drill 0.4, 0.4 pad 0.4)
  Top 0.305: 38.89,18.18 PAD3.1 39.05,17.46 v40.64,15.88 | 38.89,18.18 | IC1.18 54.93,13.96 54.93,15.48 55.56,16.12 56.52,16.12 | 56.52,16.12 56.83,16.12 v57.07,15.88 | C6.2 56.59,16.2 56.52,16.12 | JP3A.2 18.89,12.46 v19.05,12.31
  Top 0.406: IC1.6 54.06,6.34 54.06,6.36 54.29,6.59 54.29,7.54 53.9,7.94 52.78,7.94 52.7,7.86 | 41.12,1.51 41.91,0.72 47.94,0.72 49.95,2.73 C8.1 50.8,2.78 52.46,4.45 IC1.4 52.46,6.36 52.23,6.59 52.23,7.38 52.7,7.86 | 52.7,7.86
  Top 0.61: 34.92,1.51 IC3.1 37.94,1.51 | 38.89,18.18 37.94,18.18 | 37.94,18.18 PAD4.1 | 37.94,1.51 IC2.8 41.12,1.51 | 37.94,1.51 37.94,1.83 37.94,8.02 37.94,8.97 | 37.94,8.97 37.94,9.61 | 37.94,9.61 v37.94,11.99 37.94,18.18 | R1.2 | R1.2 37.94,9.61 | 37.94,8.97 35.14,8.97 C1.1 29.16,8.92 28.1,7.86 28.09,7.86 JP2.2
  Bottom 0.305: v57.07,15.88 56.83,16.12 50.01,16.12 49.77,15.88 v40.64,15.88 | v19.05,12.31 19.37,11.99 v37.94,11.99

### Text on the board
tNames: +5V | +5V | 7 | D | 7 | +18V | 6 | 6 | 32 | C | C3 | 1 | 16 | +18 | 8 | C4 | 4 | +18 | C5 | 2 | B1 | 1 | B | 1 | 1 | 1 | +5V | A | 1 | A | B | GND
bStop: PentaFnord | LedBoard 0.91 | rd | PentaFn | CtrlBoard 0.91r | https://github.com/alxlo/PentaFnord